# Altium schematic sheet PIC.SchDoc
size A4
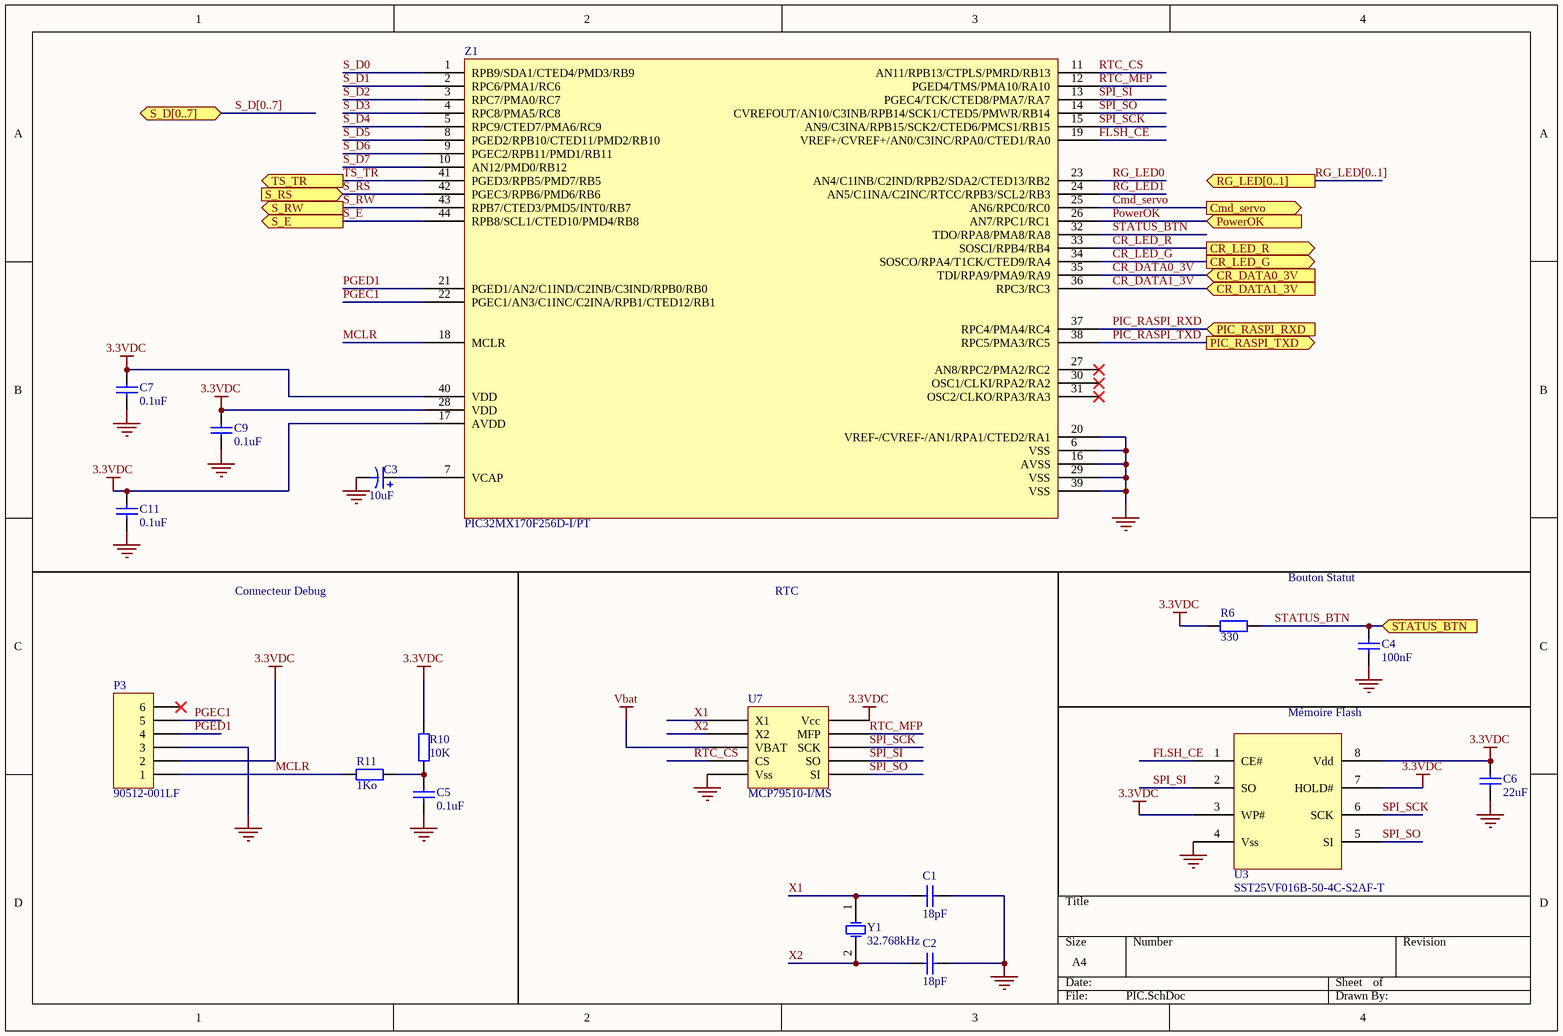
[diagram p0: PIC.SchDoc]

## Parts
C1  18pF  [0603]
C2  18pF  [0603]
C3  10uF  [C3]
C4  100nF  [0603]
C5  0.1uF  [0603]
C6  22uF  [0603]
C7  0.1uF  [0603]
C9  0.1uF  [0603]
C11  0.1uF  [0603]
P3  90512-001LF  [RJ12]
R6  330  [0603]
R10  10K  [0603]
R11  1Ko  [0603]
U3  SST25VF016B-50-4C-S2AF-T  [FLASH]
U7  MCP79510-I/MS  [rtc]
Y1  32.768kHz  [QUARTZ32KHz]
Z1  PIC32MX170F256D-I/PT  [TQFP-44_L]

## Ports
Cmd_servo (out), CR_DATA0_3V (in), CR_DATA1_3V (in), CR_LED_G (out), CR_LED_R (out), PIC_RASPI_RXD (in), PIC_RASPI_TXD (out), PowerOK (in), RG_LED[0..1] (out), S_D[0..7] (bidir), S_E (out), S_RS (in), S_RW (out), STATUS_BTN (in), TS_TR (out)

## Nets
3.3VDC: C6.2 C7.1 C9.1 C11.1 P3.2 R6.1 R10.2 U3.3(WP#) U3.7(HOLD#) U3.8(Vdd) U7.10(Vcc) Z1.17(AVDD) Z1.28(VDD) Z1.40(VDD)
GND: C1.1 C2.1 C3.2 C4.1 C5.1 C6.1 C7.2 C9.2 C11.2 P3.3 U3.4(Vss) U7.5(Vss) Z1.6(VSS) Z1.16(AVSS) Z1.20(VREF-/CVREF-/AN1/RPA1/CTED2/RA1) Z1.29(VSS) Z1.39(VSS)
Vbat: U7.3(VBAT)
Cmd_servo: Z1.25(AN6/RPC0/RC0) ; port Cmd_servo
CR_DATA0_3V: Z1.35(TDI/RPA9/PMA9/RA9) ; port CR_DATA0_3V
CR_DATA1_3V: Z1.36(RPC3/RC3) ; port CR_DATA1_3V
CR_LED_G: Z1.34(SOSCO/RPA4/T1CK/CTED9/RA4) ; port CR_LED_G
CR_LED_R: Z1.33(SOSCI/RPB4/RB4) ; port CR_LED_R
FLSH_CE: U3.1(CE#) Z1.19(VREF+/CVREF+/AN0/C3INC/RPA0/CTED1/RA0)
MCLR: P3.1 R11.2 Z1.18(MCLR)
PGEC1: P3.5 Z1.22(PGEC1/AN3/C1INC/C2INA/RPB1/CTED12/RB1)
PGED1: P3.4 Z1.21(PGED1/AN2/C1IND/C2INB/C3IND/RPB0/RB0)
PIC_RASPI_RXD: Z1.37(RPC4/PMA4/RC4) ; port PIC_RASPI_RXD
PIC_RASPI_TXD: Z1.38(RPC5/PMA3/RC5) ; port PIC_RASPI_TXD
PowerOK: Z1.26(AN7/RPC1/RC1) ; port PowerOK
RG_LED0: Z1.23(AN4/C1INB/C2IND/RPB2/SDA2/CTED13/RB2)
RG_LED1: Z1.24(AN5/C1INA/C2INC/RTCC/RPB3/SCL2/RB3)
RTC_CS: U7.4(CS) Z1.11(AN11/RPB13/CTPLS/PMRD/RB13)
RTC_MFP: U7.9(MFP) Z1.12(PGED4/TMS/PMA10/RA10)
S_D0: Z1.1(RPB9/SDA1/CTED4/PMD3/RB9)
S_D1: Z1.2(RPC6/PMA1/RC6)
S_D2: Z1.3(RPC7/PMA0/RC7)
S_D3: Z1.4(RPC8/PMA5/RC8)
S_D4: Z1.5(RPC9/CTED7/PMA6/RC9)
S_D5: Z1.8(PGED2/RPB10/CTED11/PMD2/RB10)
S_D6: Z1.9(PGEC2/RPB11/PMD1/RB11)
S_D7: Z1.10(AN12/PMD0/RB12)
S_E: Z1.44(RPB8/SCL1/CTED10/PMD4/RB8) ; port S_E
S_RS: Z1.42(PGEC3/RPB6/PMD6/RB6) ; port S_RS
S_RW: Z1.43(RPB7/CTED3/PMD5/INT0/RB7) ; port S_RW
SPI_SCK: U3.6(SCK) U7.8(SCK) Z1.15(AN9/C3INA/RPB15/SCK2/CTED6/PMCS1/RB15)
SPI_SI: U3.2(SO) U7.7(SO) Z1.13(PGEC4/TCK/CTED8/PMA7/RA7)
SPI_SO: U3.5(SI) U7.6(SI) Z1.14(CVREFOUT/AN10/C3INB/RPB14/SCK1/CTED5/PMWR/RB14)
STATUS_BTN: C4.2 R6.2 Z1.32(TDO/RPA8/PMA8/RA8) ; port STATUS_BTN
TS_TR: Z1.41(PGED3/RPB5/PMD7/RB5) ; port TS_TR
X1: C1.2 U7.1(X1) Y1.1(OSC1)
X2: C2.2 U7.2(X2) Y1.2(OSC2)
NetC3_1: C3.1 Z1.7(VCAP)
NetC5_2: C5.2 R10.1 R11.1

Not connected (* = marked no-connect by the designer): P3 6*; Z1 27(AN8/RPC2/PMA2/RC2)* 30(OSC1/CLKI/RPA2/RA2)* 31(OSC2/CLKO/RPA3/RA3)*

## Buses and harness runs
bus RG_LED[0..1] = port RG_LED[0..1]
bus S_D[0..7] = port S_D[0..7]

## Notes on the sheet
- Bouton Statut
- Connecteur Debug
- RTC
- Mémoire Flash

## Library data of the parts
C1 C2 = Cap: Capacitor; Fournisseur: Farnell; Fabricant: AVX; Ref.Fabricant: 02013A180JAT2A; Ref.Fournisseur: 1740563
C3 = Cap Pol1: Fournisseur: Farnell; Ref.Fournisseur: 2353238; Ref.Fabricant: TL3C106K025C0450..; Fabricant: VISHAY
C4 = Cap: Capacitor; Fournisseur: Farnell; Ref.Fournisseur: 2812613; Fabricant: WURTH ELECTRONIK; Ref.Fabricant: 885342211005; Value: 100nF
C5 C7 C9 C11 = Cap: Capacitor; Fournisseur: Farnell; Fabricant: Multicomp; Ref.Fabricant: MCY4C3B104M160CT; Ref.Fournisseur: 2310273; Value: 0.1uF
C6 = Cap: Cout_Reg_3.3v; Fournisseur: Farnell; Fabricant: AVX; Ref.Fabricant: 12103D226KAT2A; Ref.Fournisseur: 1833829; Value: 22uF
P3 = Header 6: PortRJ12_debug; Fournisseur: Farnell; Fabricant: Amphenol ICC; Ref.Fournisseur: 1097914; Ref.Fabricant: 90512-001LF
R6 = Res2: Resistor; Fabricant: TE Connectivity; Fournisseur: Farnell; Ref.Fabricant: RN73C1J232RBTDF; Ref.Fournisseur: 2687973
R10 = Res2: Resistor; Fournisseur: Farnell; Fabricant: TE CONNECTIVITY; Ref.Fabricant: CPF0201D10KC1; Ref.Fournisseur: 2117887; Value: 10k
R11 = Res2: Resistor; Value: 1K; Fournisseur: Farnell; Fabricant: TE CONNECTIVITY; Ref.Fabricant: CPF0201D1K0E1; Ref.Fournisseur: 2117780
U3 = Memoire: FLASH; Fournisseur: Farnell; Fabricant: Microchip; Ref.Fabricant: SST25VF016B-50-4I-S2AF-T; Ref.Fournisseur: 2774943
U7 = MCP79510: RTC; Fournisseur: Farnell; Ref.Fournisseur: 2361124; Fabricant: Microchip; Ref.Fabricant: MCP79510-I/MS
Y1 = XTAL: Crystal Oscillator; Fournisseur: Farnell; Fabricant: ABRACON; Ref.Fabricant: ABS07-32.768KHZ-7-T; Ref.Fournisseur: 1838935
Z1 = PIC32_1: PIC; Fournisseur: Farnell; Fabricant: MICROCHIP; Ref.Fournisseur: 2456845; Ref.Fabricant: PIC32MX170F256D-I/PT